# EAGLE design openSX70-dongle-USB-V1 (EAGLE 9.2.0)
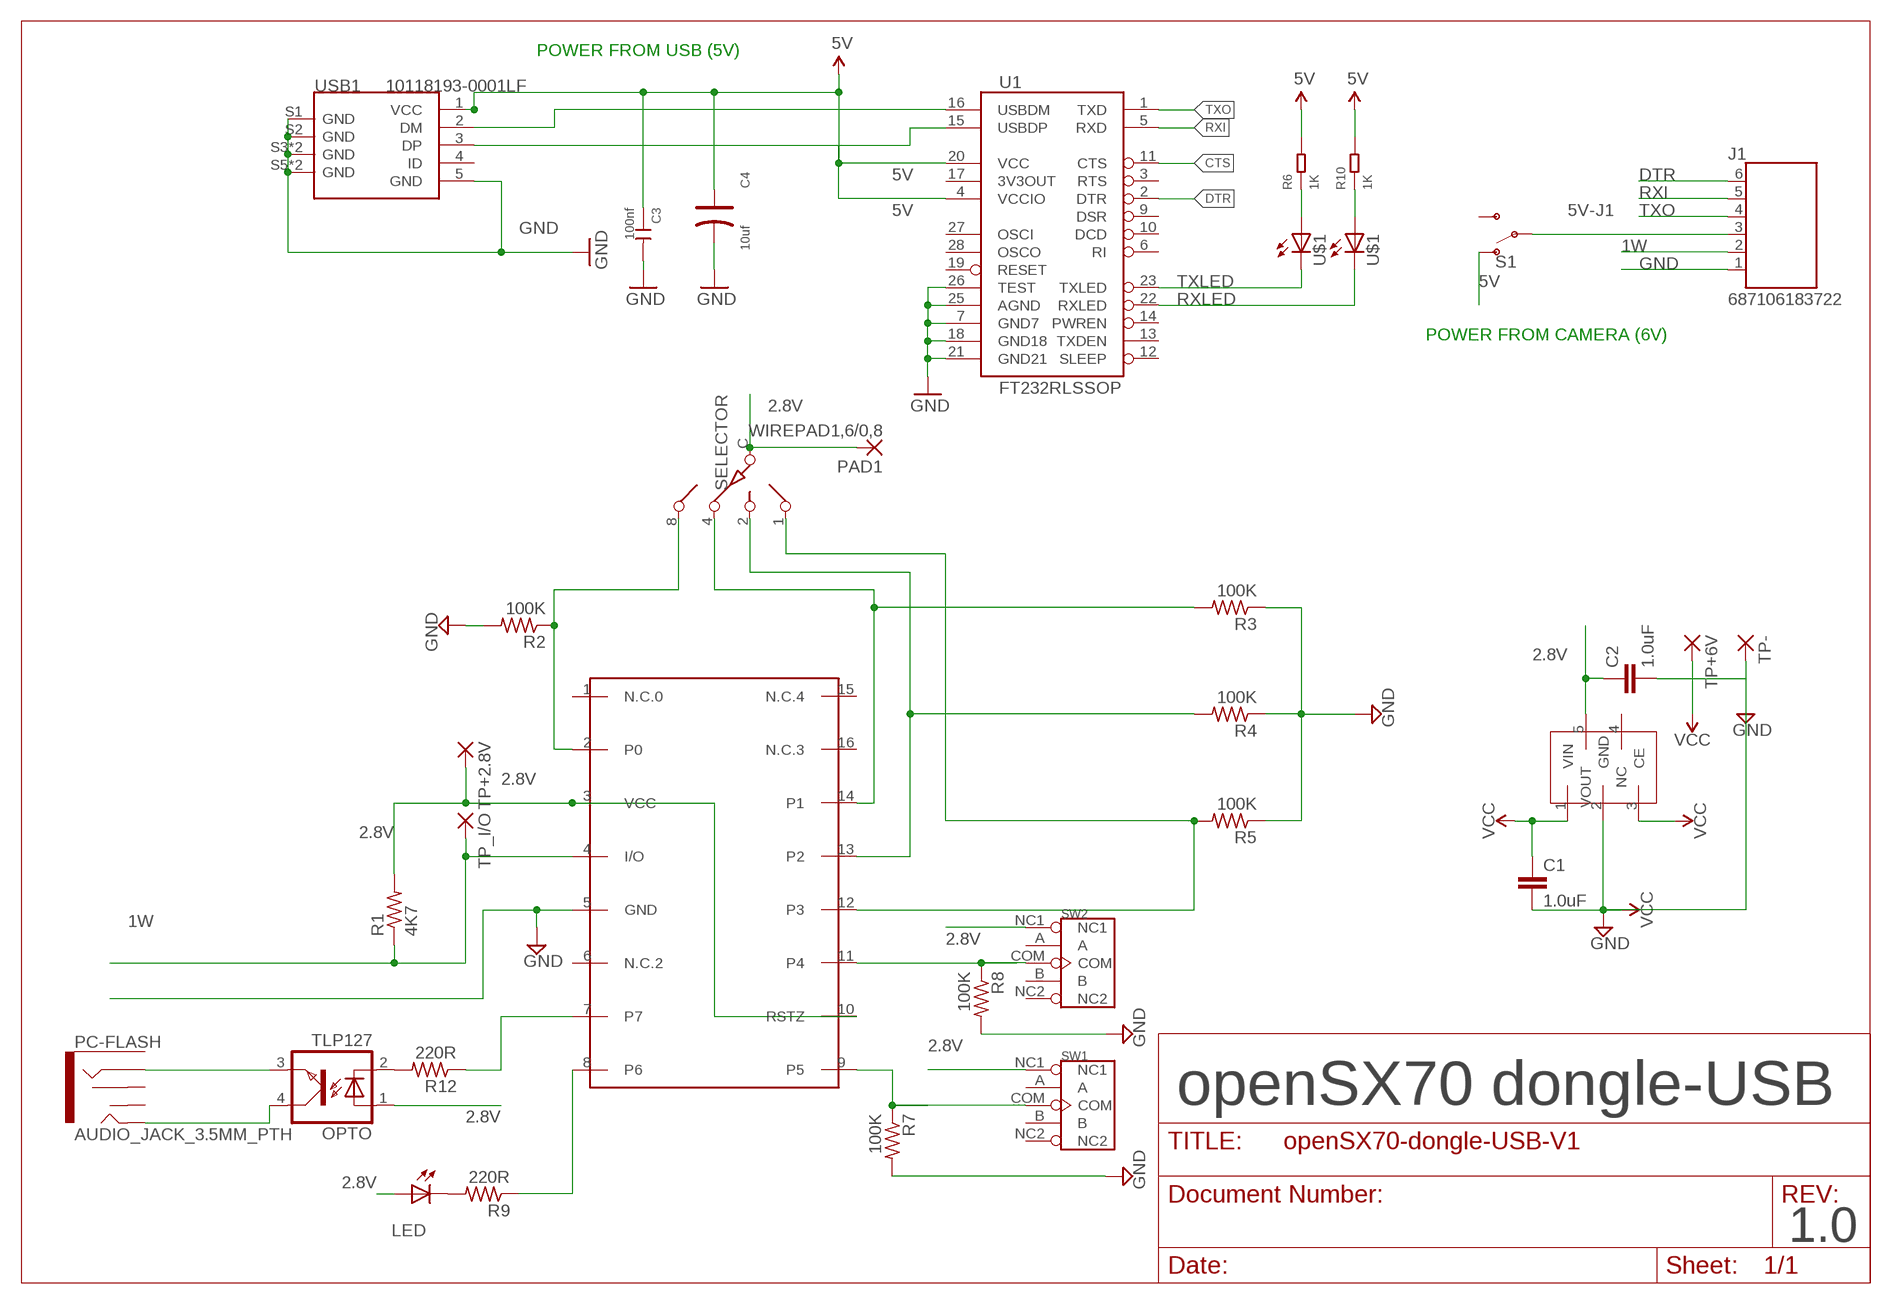
[diagram p0: schematic, sheet 1]

## Parts
C1  1.0uF  C-EUC0603  [C0603]
C2  1.0uF  C-EUC0603  [C0603]
C3  100nf  CERAMIC-100NF-50V-10%-X7R(0603)  [C0603]
C4  10uf  TANTALUM-SMD-10UF-16V-10%(AVX-A)  [AVX-A]
DS2408  DS2408  [SO16]
J1  687106183722  [687106183722]
LED  LED3MM  [LED3MM]
OPTO  TLP127  [SO-4]
PAD1  WIREPAD1,6/0,8  [1,6/0,8]
PC-FLASH  AUDIO_JACK_3.5MM_PTH  [AUDIO-JACK]
R1  4K7  R-US_M0805  [M0805]
R2  100K  R-US_M0805  [M0805]
R3  100K  R-US_M0805  [M0805]
R4  100K  R-US_M0805  [M0805]
R5  100K  R-US_M0805  [M0805]
R6  1K  SMD-RES-1K-1%-1/10W(0603)  [R0603]
R7  100K  R-US_M0805  [M0805]
R8  100K  R-US_M0805  [M0805]
R9  220R  R-US_M0805  [M0805]
R10  1K  SMD-RES-1K-1%-1/10W(0603)  [R0603]
R12  220R  R-US_M0805  [M0805]
REG  NCP4688  [SOT-23-5]
S1  SWITCH-SPDT-SMD-RIGHT-ANGLE  [SWITCH_SPST_SMD_A]
SELECTOR  SW-C16  [SW-C16]
SW1  DIP-TOGGLE-SWITCH-ON-ON(3+2P-8.8X4.6MM)-90D  [SW5-2.0-8.8X4.4X4.7MM-90D]
SW2  DIP-TOGGLE-SWITCH-ON-ON(3+2P-8.8X4.6MM)-90D  [SW5-2.0-8.8X4.4X4.7MM-90D]
TP+2.8V  SMD2  [SMD1,27-2,54]
TP+6V  SMD2  [SMD1,27-2,54]
TP-  SMD2  [SMD1,27-2,54]
TP_I/O  SMD2  [SMD1,27-2,54]
U1  FT232RLSSOP  [SSOP28DB]
U$1  DUAL-LED-0603-BIS  [LED_APHB1608SYKSURKC]
USB1  10118193-0001LF  MICRO-USB-SMD-B-(10118193-0001LF)  [MICRO-USB5+6P-SMD-0.65-B]

## Nets
1W: DS2408.4(I/O) J1.2 R1.1 TP_I/O.1(P)
2.8V: C2.1 DS2408.3(VCC) DS2408.10(RSTZ) LED.A OPTO.1(A) PAD1.1(P) R1.2 REG.5(VOUT) SELECTOR.C SW1.NC1 SW2.NC1 TP+2.8V.1(P)
5V: C3.1 C4.+ R6.2 R10.2 S1.1(O) U1.4(VCCIO) U1.20(VCC) USB1.1(VCC)
5V-J1: J1.3 S1.2(P)
CTS: U1.11(CTS)
DTR: J1.6 U1.2(DTR)
GND: C1.2 C2.2 C3.2 C4.- DS2408.5(GND) J1.1 R2.2 R3.1 R4.1 R5.1 R7.2 R8.2 REG.2(GND) TP-.1(P) U1.7(GND7) U1.18(GND18) U1.21(GND21) U1.25(AGND) U1.26(TEST) USB1.5(GND) USB1.S1(GND) USB1.S2(GND) USB1.S3(GND) USB1.S4(GND) USB1.S5(GND) USB1.S6(GND)
N$2: LED.K(C) R9.2
N$3: DS2408.2(P0) R2.1 SELECTOR.8
N$4: DS2408.14(P1) R3.2 SELECTOR.4
N$5: DS2408.13(P2) R4.2 SELECTOR.2
N$6: DS2408.11(P4) R8.1 SW2.COM
N$7: DS2408.9(P5) R7.1 SW1.COM
N$8: DS2408.8(P6) R9.1
N$9: R6.1 U$1.1(A)
N$10: OPTO.2(C) R12.2
N$11: DS2408.7 R12.1
N$12: OPTO.4(COL) PC-FLASH.TIP
N$13: DS2408.12(P3) R5.2 SELECTOR.1
N$14: R10.1 U$1.3(A1)
N$15: OPTO.3(EMIT) PC-FLASH.RING
N$16: U1.16(USBDM) USB1.2(DM)
RXI: J1.5 U1.5(RXD)
RXLED: U1.22(RXLED) U$1.4(C1)
TXLED: U1.23(TXLED) U$1.2(C)
TXO: J1.4 U1.1(TXD)
USB_D+: U1.15(USBDP) USB1.3(DP)
VCC: C1.1 REG.1(VIN) REG.3(CE) TP+6V.1(P)
Unconnected: DS2408.1(N.C.0) DS2408.6(N.C.2) DS2408.15(N.C.4) DS2408.16(N.C.3) PC-FLASH.RSH PC-FLASH.SLEEVE PC-FLASH.TSH REG.4(NC) S1.3(S) SW1.A SW1.B SW1.NC2 SW2.A SW2.B SW2.NC2 U1.3(RTS) U1.6(RI) U1.9(DSR) U1.10(DCD) U1.12(SLEEP) U1.13(TXDEN) U1.14(PWREN) U1.17(3V3OUT) U1.19(RESET) U1.27(OSCI) U1.28(OSCO) USB1.4(ID)

## Notes on the sheet
- POWER FROM USB (5V)
- POWER FROM CAMERA (6V)
- openSX70 dongle-USB
- 1.0

## Library data of the parts
C1 C2 = rcl:C-EU: CAPACITOR, European symbol; SPICEPREFIX: C
C3 = openSX70_PATHFINDER_V5.5-SEEED_20180522:CERAMIC-100NF-50V-10%-X7R(0603): 302010138; MPN: CC0603KRX7R9BB104
C4 = Seeed-Capacitor-2016:TANTALUM-SMD-10UF-16V-10%(AVX-A): 302020002; MPN: TAJA106K016RNJ
DS2408 = DS2408-joaco:DS2408
J1 = openSX70_PATHFINDER_V5.5-SEEED_20180522:687106183722: 687106183722 WR-FPC 0.50mm SMT Horizontal Bottom Contact - Low Profile <http://katalog.we-online.de/media/images/v2/Family_WR-FPC_6871xx183722.jpg> Details see: http://katalog.we-online.de/en/em/FPC_0_5_SMT_ZIF_HORIZONTAL_BOTTOM_CONTACT_LOW_PROFILE_6871xx183722 Created by Yingchun,shan 2016 (C) Wurth Elektronik; AVAILABILITY: Good; DESCRIPTION: CONN FFC BTM 6POS 0.5MM SMD R/A; MF: Wurth Electronics; MP: 687106183722; PACKAGE: None; PRICE: 1.21 USD
LED = adafruit:LED: LED OSRAM: - CHIPLED LG R971, LG N971, LY N971, LG Q971, LY Q971, LO R971, LY R971 LH N974, LH R974 LS Q976, LO Q976, LY Q976 LO Q996 - Hyper CHIPLED LW Q18S LB Q993, LB Q99A, LB R99A - SideLED LS A670, LO A670, LY A670, LG A670, LP A670 LB A673, LV A673, LT A673, LW A673 LH A674 LY A675 LS A676, LA A676, LO A676, LY A676, LW A676 LS A679, LY A679, LG A679 - Hyper Micro SIDELED® LS Y876, LA Y876, LO Y876, LY Y876 LT Y87S - SmartLED LW L88C, LW L88S LB L89C, LB L89S, LG L890 LS L89K, LO L89K, LY L89K LS L896, LA L896, LO L896, LY L896 - TOPLED LS T670, LO T670, LY T670, LG T670, LP T670 LSG T670, LSP T670, LSY T670, LOP T670, LYG T670 LG T671, LOG T671, LSG T671 LB T673, LV T673, LT T673, LW T673 LH T674 LS T676, LA T676, LO T676, LY T676, LB T676, LH T676, LSB T676, LW T676 LB T67C, LV T67C, LT T67C, LS T67K, LO T67K, LY T67K, LW E67C LS E67B, LA E67B, LO E67B, LY E67B, LB E67C, LV E67C, LT E67C LW T67C LS T679, LY T679, LG T679 LS T770, LO T770, LY T770, LG T770, LP T770 LB T773, LV T773, LT T773, LW T773 LH T774 LS E675, LA E675, LY E675, LS T675 LS T776, LA T776, LO T776, LY T776, LB T776 LHGB T686 LT T68C, LB T68C - Hyper Mini TOPLED® LB M676 - Mini TOPLED Santana® LG M470 LS M47K, LO M47K, LY M47K Source: http://www.osram.convergy.de/
OPTO = openSX70:TLP127
PAD1 = wirepad:WIREPAD: Wire PAD connect wire on PCB
PC-FLASH = SparkFun-Connectors:AUDIO_JACK_3.5MM: Audio Jack 3.5mm variants of PTH and SMT stereo audio jack with bypass switches. SparkFun Products: SparkFun SparkPunk Sound Kit <[https://www.sparkfun.com/products/11177]> - PTH MP3 Trigger <https://www.sparkfun.com/products/13720> -3.5mm SMD SparkFun PicoBoard <https://www.sparkfun.com/products/11888>- 2.5mm SMD; PROD_ID: CONN-08774; SF_ID: PRT-08032
R1-R5 R7-R9 R12 = rcl:R-US_: RESISTOR, American symbol; SPICEPREFIX: R
R6 R10 = openSX70_PATHFINDER_V5.5-SEEED_20180522:SMD-RES-1K-1%-1/10W(0603): 301010298; MPN: RC0603FR-071KL
REG = openSX70:NCP4688
S1 = SparkFun-Switches:SWITCH-SPDT: Single Pole, Double Throw (SPDT) Switch Single-pole, double-throw (SPDT) switch. Variant Overview SMD-AYZ0202 Surface Mount DPDT Switch <https://www.sparkfun.com/products/597> (COM-00597) Used on e.g. LilyPad Arduino USB - ATmega32U4 Board <https://www.sparkfun.com/products/12049> PTH-11.6X4.0MM SPDT Mini Power Switch <https://www.sparkfun.com/products/102> (COM-00102) Used on e.g. SparkFun Simon Says - Through-Hole Soldering Kit <https://www.sparkfun.com/products/10547> (KIT-10547) PTH-11.6X4.0MM-KIT KIT version of SPDT Mini Power Switch - Simplifies soldering by removing tStop of switch pins - only one side can be soldered. PTH-11.6X4.0MM-LOCK LOCK version of SPDT Mini Power Switch - Offset pins hold switch in place for easier soldering. SMD-RIGHT-ANGLE Surface Mount Right Angle Switch <https://www.sparkfun.com/products/10860> (COM-10860) Used on e.g. SparkFun ESP8266 Thing <https://www.sparkfun.com/products/13231>; PROD_ID: SWCH-10651; SF_SKU: COM-10860
SELECTOR = special:SW-C16: SWITCH 16-step rotary switch
SW1 SW2 = Seeed-Switch:DIP-TOGGLE-SWITCH-ON-ON(3+2P-8.8X4.6MM)-90D: 311030008; MPN: 3P-2.0-90D3P-2.0-90D-REINFORCE
TP+2.8V TP+6V TP- TP_I/O = wirepad:SMD2: SMD PAD
U1 = SparkFun:FT232RL: USB UART FT232RL 4th Generation USB UART (USB <-> Serial) Controller. Spark Fun Electronics SKU : COM-00650
U$1 = _openSX70:DUAL-LED-0603-BIS
USB1 = Seeed-Connector -2016:MICRO-USB-SMD-B-(10118193-0001LF): 320010003; MPN: 10118193-0001LF

## Net classes
0 GND: width 0.305 mm
1 power: width 0.254 mm
2 2.8V: width 0.254 mm

## Board
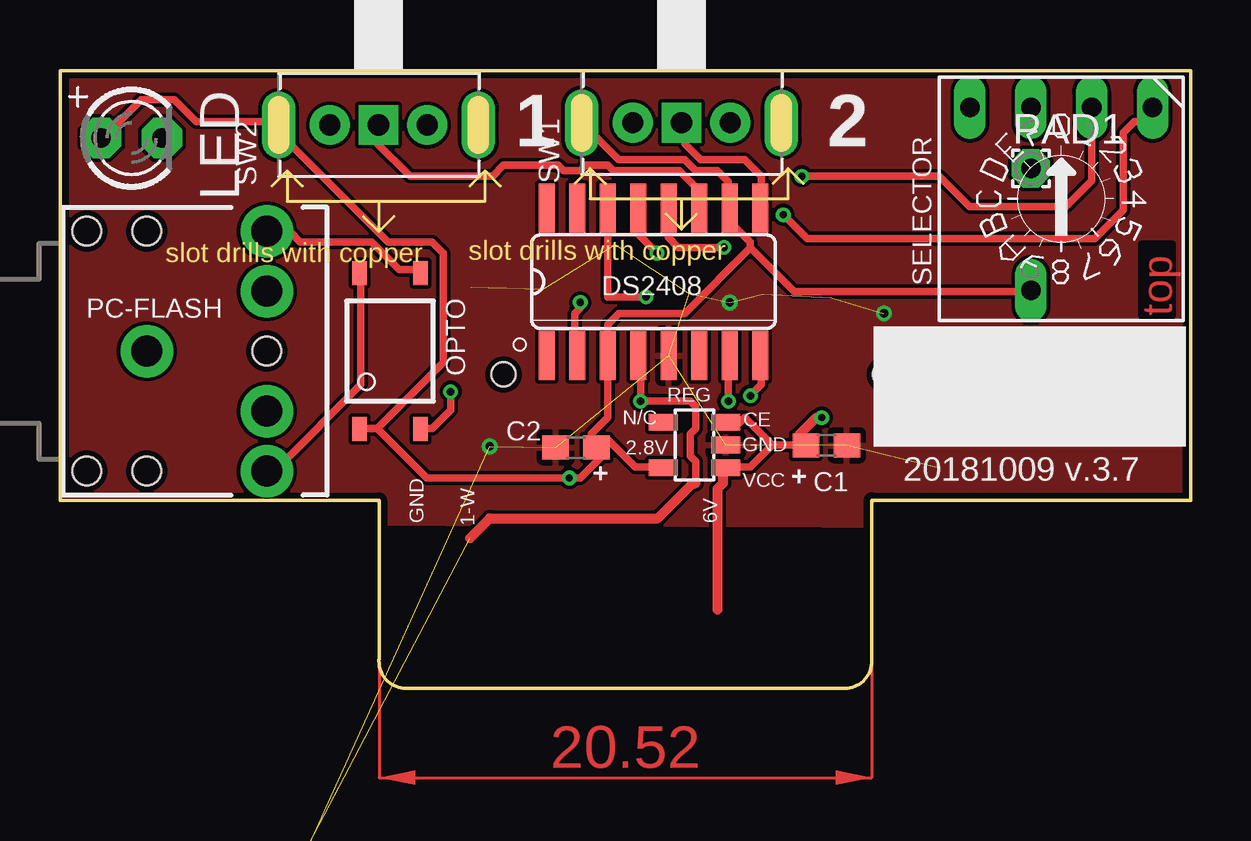
[diagram p1: board, top side]
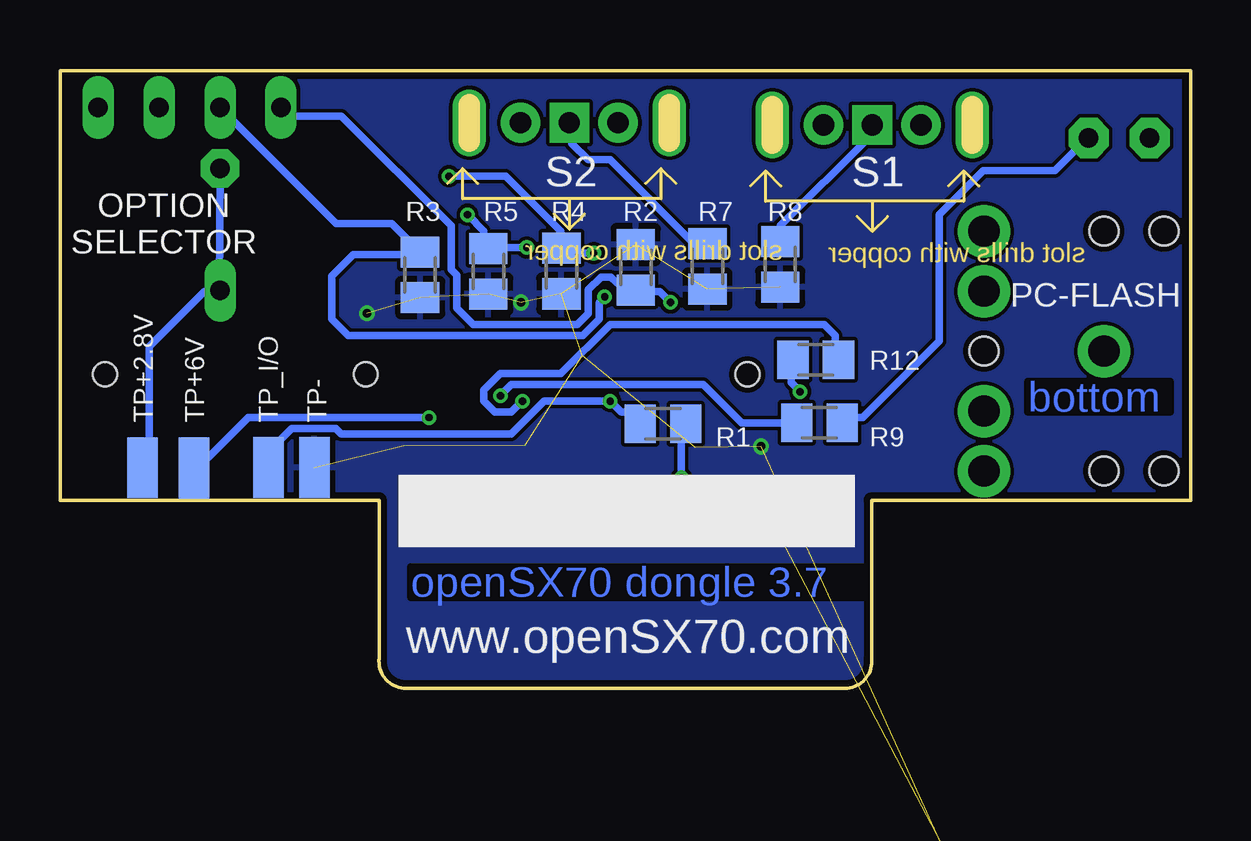
[diagram p2: board, bottom side, seen from below]

Size 47.12 x 25.74 mm. Coordinates in mm from the lower left corner, seen from the top.
Outline: 33.84,7.71 33.82,7.83
Outline: 33.82,7.83 33.82,1.24 arc-90 32.8,0 14.31,0 arc-90 13.3,1.24 13.3,7.83 0,7.83 0,25.74 47.12,25.74 47.12,7.83 33.82,7.83
Copper layers (1*16): Top 0.035mm / dielectric 1.5mm / Bottom 0.035mm
Design rules "SeeedStudio_2layer_DRU_no_angle_20140221": minimum track width 6mil, minimum drill 12mil, track to track 6mil, track to pad 6mil, pad to pad 6mil, via to via 6mil, smd to smd 0mil, copper to edge 10mil, drill to drill 10mil, minimum pad ring 10mil, minimum via ring 6mil, stop-mask expansion 2mil, vias tented up to drill 100mil, thermal gap 10mil
Holes 1 mm at 18.48,13.09 34.38,13.09 45.25,13.09

### Footprints (pad centres in the part's own frame; a part is rotated, then mirrored left to right if it is on the bottom)
C0603 = smd 1.1 x 1: 1 -0.85,0; 2 0.85,0
C0603' = smd 0.889 x 0.889: 1 0,0.762; 2 0,-0.762
AVX-A = smd 1.27 x 1.27: + -1.27,0; - 1.27,0
SO16 = smd 0.66 x 2.032: 1 -4.445,-3.073; 2 -3.175,-3.073; 3 -1.905,-3.073; 4 -0.635,-3.073; 5 0.635,-3.073; 6 1.905,-3.073; 7 3.175,-3.073; 8 4.445,-3.073; 9 4.445,3.073; 10 3.175,3.073; 11 1.905,3.073; 12 0.635,3.073; 13 -0.635,3.073; 14 -1.905,3.073; 15 -3.175,3.073; 16 -4.445,3.073
687106183722 = smd 0.3 x 1: 1 -1.25,1.9; 2 -0.75,1.9; 3 -0.25,1.9; 4 0.25,1.9; 5 0.75,1.9; 6 1.25,1.9 | smd 1.65 x 1.3: Z1 -3.525,0; Z2 3.525,0
LED3MM = drill 0.813 pad 1.676 octagon: A -1.27,0; K 1.27,0
SO-4 = smd 1 x 0.6: 1 -3.24,0.635; 2 -3.24,-1.905; 3 3.24,-1.905; 4 3.24,0.635
1,6/0,8 = drill 0.813 pad 1.6 octagon: 1 0,0
AUDIO-JACK = drill 1.3 pad 2.184: RING 5,5; RSH 5,2.5; SLEEVE 0,0; TIP 5,-5; TSH 5,-2.5 | hole 1.2: 0,5; -2.5,5; -2.5,-5; 0,-5; 5,0
M0805 = smd 1.3 x 1.6: 1 -0.95,0; 2 0.95,0
R0603 = smd 0.889 x 0.889: 1 0,0.762; 2 0,-0.762
SOT-23-5 = smd 0.69 x 1.2: 1 -0.95,-1.3; 2 0,-1.3; 3 0.95,-1.3; 4 0.95,1.3; 5 -0.95,1.3
SWITCH_SPST_SMD_A = smd 0.7 x 1.5: 1 -2.25,-1.75; 2 -0.75,-1.75; 3 2.25,-1.75 | smd 1 x 0.6: GND1 -3.65,1; GND3 3.65,1 | smd 1 x 0.8: GND2 -3.65,-1.1; GND4 3.65,-1.1 | hole 0.9: -1.5,0; 1.5,0
SW-C16 = drill 0.813 long: 1 -3.81,-3.81; 2 -1.27,-3.81; 4 1.27,-3.81; 8 3.81,-3.81; C 1.27,3.81
SW5-2.0-8.8X4.4X4.7MM-90D = drill 0.889 pad 1.651: A 0,2.032; B 0,-2.032 | drill 0.889 pad 1.651 square: COM 0,0 | drill 0.762 pad 1.397 long: NC1 0,4.166; NC2 0,-4.166
SMD1,27-2,54 = smd 1.27 x 2.54: 1 0,0
SSOP28DB = smd 0.348 x 1.397: 1 -4.225,-3.656; 2 -3.575,-3.656; 3 -2.925,-3.656; 4 -2.275,-3.656; 5 -1.625,-3.656; 6 -0.975,-3.656; 7 -0.325,-3.656; 8 0.325,-3.656; 9 0.975,-3.656; 10 1.625,-3.656; 11 2.275,-3.656; 12 2.925,-3.656; 13 3.575,-3.656; 14 4.225,-3.656; 15 4.225,3.656; 16 3.575,3.656; 17 2.925,3.656; 18 2.275,3.656; 19 1.625,3.656; 20 0.975,3.656; 21 0.325,3.656; 22 -0.325,3.656; 23 -0.975,3.656; 24 -1.625,3.656; 25 -2.275,3.656; 26 -2.925,3.656; 27 -3.575,3.656; 28 -4.225,3.656
LED_APHB1608SYKSURKC = smd 0.5 x 0.4: 1 -0.6,0.35; 2 0.6,0.35; 3 -0.6,-0.35; 4 0.6,-0.35
MICRO-USB5+6P-SMD-0.65-B = smd 0.4 x 1.5: 1 -1.3,-0.25; 2 -0.65,-0.25; 3 0,-0.25; 4 0.65,-0.25; 5 1.3,-0.25 | smd 1.6 x 1.4: S1 -3.4,-0.427; S6 3.4,-0.427 | drill 0.508 pad 1.016 long: S2 -3.3,-2.675; S5 3.3,-2.675 | smd 1.9 x 1.9: S3 -1.2,-2.675; S4 1.2,-2.675

### Placement (x,y rotation side)
C1  31.94,10.13 0 top
C2  21.5,10.04 180 top
C3  100nf  [C0603']  -0.1,-45.91 0 top  (outside the outline)
C4  19.9,-32.91 0 top  (outside the outline)
DS2408  24.73,16.95 0 top
J1  1.9,-25.91 0 top  (outside the outline)
LED  2.98,22.95 0 top
OPTO  13.12,14.06 90 top
PAD1  40.45,21.68 0 top
PC-FLASH  3.62,14.06 0 top
R1  21.99,11.03 0 bottom
R2  23.13,17.55 90 bottom
R3  32.11,17.24 90 bottom
R4  26.23,17.4 90 bottom
R5  29.27,17.38 90 bottom
R6  14.9,-40.91 0 top  (outside the outline)
R7  20.14,17.59 270 bottom
R8  17.11,17.68 270 bottom
R9  15.47,11.07 0 bottom
R10  19.9,-40.91 0 top  (outside the outline)
R12  15.63,13.7 180 bottom
REG  26.44,10.14 90 top
S1  12.9,-33.91 0 top  (outside the outline)
SELECTOR  41.72,20.41 180 top
SW1  25.9,23.58 90 top
SW2  13.27,23.49 90 top
TP+2.8V  43.68,9.2 180 bottom
TP+6V  41.53,9.19 180 bottom
TP-  36.52,9.2 0 bottom
TP_I/O  38.43,9.21 0 bottom
U1  2.9,-34.91 0 top  (outside the outline)
U$1  -24.1,-49.91 0 top  (outside the outline)
USB1  3.9,-12.91 0 top  (outside the outline)

### Tracks (layer width: path | path; a pad name or v marks a point on that pad's centre or on a via)
1W  (via drill 0.3)  (1 unrouted)
  Top 0.305: DS2408.4 24.19,13.8 v24.19,11.97 26.25,11.97 26.48,11.74 26.48,10.83 26.25,10.6 26.25,9.69 26.48,9.46 26.48,8.54
  Top 0.406: 17.08,6.26 17.9,7.09 24.9,7.09 26.36,8.54 26.48,8.54
  Bottom 0.305: R1.1 23.05,11.06 23.51,11.52 23.74,11.52 v24.19,11.97 26.94,11.97 28.31,10.6 35.39,10.6 35.62,10.83 37.45,10.83 38.37,9.92 38.37,9.23 TP_I/O.1
2.8V  (via drill 0.3)
  Top 0.305: LED.A 1.79,22.95 3.39,24.55 4.76,24.55 5.68,23.63 9.11,23.63 SW2.NC1 9.11,23.4 9.56,22.95 9.56,22.72 13.68,18.6 15.51,18.6 15.96,18.14 15.96,13.57 13.22,10.83 | SW1.NC1 23.28,22.03 26.02,22.03 26.48,21.57 27.39,21.57 27.85,21.12 27.85,20.2 DS2408.10 28.08,19.97 28.08,19.29 28.77,18.6 28.77,18.37 | 13.22,10.83 12.53,10.83 OPTO.1 | 13.22,10.83 15.28,8.77 v21.22,8.77 21.68,8.77 22.59,9.69 22.59,9.92 22.36,10.14 | 22.36,10.14 22.59,10.37 22.82,10.37 23.96,9.23 25.11,9.23 REG.5 | 22.36,10.14 C2.1 22.14,10.14 22.14,10.6 22.82,11.29 22.82,13.8 DS2408.3 22.82,14.03 22.82,15.17 23.28,15.63 26.02,15.63 28.77,18.37 | 28.77,18.37 30.59,16.54 40.42,16.54 SELECTOR.C
  Bottom 0.305: v21.22,8.77 21.22,10.83 R1.2 | 40.64,16.55 40.65,16.54 41.11,16.54 43.4,14.26 43.4,9.46 43.62,9.23 TP+2.8V.1 | 40.64,16.55 SELECTOR.C | PAD1.1 40.49,16.7 40.64,16.55
5V  (7 unrouted)
5V-J1  (1 unrouted)
DTR  (1 unrouted)
GND  (via drill 0.35)  (28 unrouted)
  other vias: 17.9,10.09 27.9,16.09 34.33,15.63
  pour Top: 0.44,25.49 47.43,25.49 47.43,6.71 0.44,6.89
  pour Bottom: 0.44,25.49 0.44,6.71 13.14,6.71 13.14,0.36 33.46,0.36 33.46,6.71 47.43,6.71 47.43,25.49
N$2
  Bottom 0.305: R9.2 14.36,11.29 13.68,11.29 10.48,14.49 10.48,19.75 8.65,21.57 5.68,21.57 4.31,22.95 LED.K
N$3  (via drill 0.3)
  Top 0.305: v21.68,16.09 21.68,15.86 21.45,15.63 21.45,14.03 DS2408.2
  Bottom 0.305: v21.68,16.09 22.14,16.54 23.05,16.54 R2.1 23.39,16.89 23.9,16.89 24.16,17.15 24.57,17.15 25.11,16.61 25.11,15.63 25.57,15.17 29.91,15.17 30.59,15.86 30.59,17.23 30.82,17.46 30.82,19.29 35.39,23.86 37.68,23.86 37.91,24.09 SELECTOR.8
N$4  (via drill 0.3)
  Top 0.305: DS2408.14 22.82,19.97 22.82,16.32 v24.42,16.32
  Bottom 0.305: SELECTOR.4 35.61,19.37 33.29,19.37 R3.2 32.21,18.09 34.9,18.09 35.79,17.2 35.79,15.4 35.11,14.72 25.34,14.72 24.65,15.4 24.65,16.09 v24.42,16.32
N$5  (via drill 0.3)
  Top 0.305: v24.88,18.14 23.96,19.06 23.96,19.97 DS2408.13 | v30.91,21.35 36.64,21.35 37.9,20.09 41.9,20.09 42.99,21.17 SELECTOR.2
  Bottom 0.305: v24.88,18.14 26.02,18.14 R4.2 26.25,18.37 26.25,19.06 28.54,21.35 v30.91,21.35
N$6
  Top 0.305: DS2408.11 26.48,20.2 26.48,20.89 25.79,21.57 23.05,21.57 22.82,21.8 21.91,21.8 21.68,21.57 20.99,21.57 20.76,21.8 18.48,21.8 18.02,21.35 14.59,21.35 13.22,22.72 13.22,23.4 SW2.COM
  Bottom 0.305: R8.1 17.11,19.29 13.45,22.95 13.45,23.4 SW2.COM
N$7
  Top 0.305: DS2408.9 29.22,20.2 29.22,21.35 28.54,22.03 26.71,22.03 26.02,22.72 26.02,23.4 SW1.COM
  Bottom 0.305: R7.1 20.31,18.6 20.76,18.6 24.19,22.03 25.11,22.03 25.79,22.72 25.79,23.4 SW1.COM
N$8  (via drill 0.3)
  Top 0.305: v28.77,12.2 29.22,12.66 29.22,13.8 DS2408.8
  Bottom 0.305: v28.77,12.2 28.31,12.66 20.31,12.66 18.71,11.06 16.65,11.06 R9.1
N$9  (1 unrouted)
N$10  (via drill 0.3)
  Top 0.305: v16.28,12.37 16.28,11.6 15.51,10.83 15.05,10.83 OPTO.2
  Bottom 0.305: v16.28,12.37 16.65,12.74 16.65,13.57 R12.2
N$11  (via drill 0.3)
  Top 0.305: v27.85,11.97 27.85,13.8 DS2408.7
  Bottom 0.305: v27.85,11.97 28.31,11.52 28.99,11.52 29.45,11.97 29.45,12.43 28.77,13.12 26.25,13.12 24.19,15.17 15.28,15.17 14.82,14.72 14.82,13.8 R12.1
N$12
  Top 0.305: OPTO.4 12.53,17.23 12.53,12.66 9.11,9.23 8.65,9.23 PC-FLASH.TIP
N$13  (via drill 0.3)
  Top 0.305: v27.67,18.38 25.76,18.38 25.34,18.8 25.34,19.97 DS2408.12 | v30.14,19.75 31.14,18.75 43.11,18.75 44.31,19.95 44.31,23.17 44.77,23.63 45,23.63 45.45,24.09 SELECTOR.1
  Bottom 0.305: v27.67,18.38 29.21,18.38 R5.2 29.45,18.37 29.45,19.06 v30.14,19.75
N$14  (1 unrouted)
N$15
  Top 0.305: OPTO.3 14.82,17.46 14.14,17.46 12.99,18.6 10.02,18.6 9.56,19.06 8.65,19.06 PC-FLASH.RING
N$16  (1 unrouted)
RXI  (1 unrouted)
RXLED  (1 unrouted)
TXLED  (1 unrouted)
TXO  (1 unrouted)
USB_D+  (1 unrouted)
VCC  (via drill 0.3)
  Top 0.305: 29.68,10.14 30.82,10.14 | 30.82,10.14 31.05,10.14 C1.1 30.82,10.14 | 29.68,10.14 28.54,11.29 28.31,11.06 27.85,11.06 REG.3 | 29.68,10.14 28.77,9.23 27.85,9.23 REG.1 27.62,9 | 30.82,10.14 30.82,10.6 | 31.51,11.29 v31.74,11.29
  Top 0.406: 30.82,10.6 31.51,11.29 | 27.39,3.29 27.39,8.32 27.62,8.54 27.62,9
  Bottom 0.305: v31.74,11.29 39.28,11.29 41.34,9.23 TP+6V.1
(copper drawn outside any net)
  shapes: Top area x1

### Text on the board
Top: top
Bottom: bottom | openSX70 dongle 3.7
tPlace: 1 | 2 | + | 20181009 v.3.7 | +
bPlace: www.openSX70.com
tNames: N/C | CE | 2.8V | GND | VCC | GND | 1-W | 6V
bNames: S1 | S2 | OPTION / SELECTOR | PC-FLASH